# Altium project 004.tg1304ap.PrjPcb
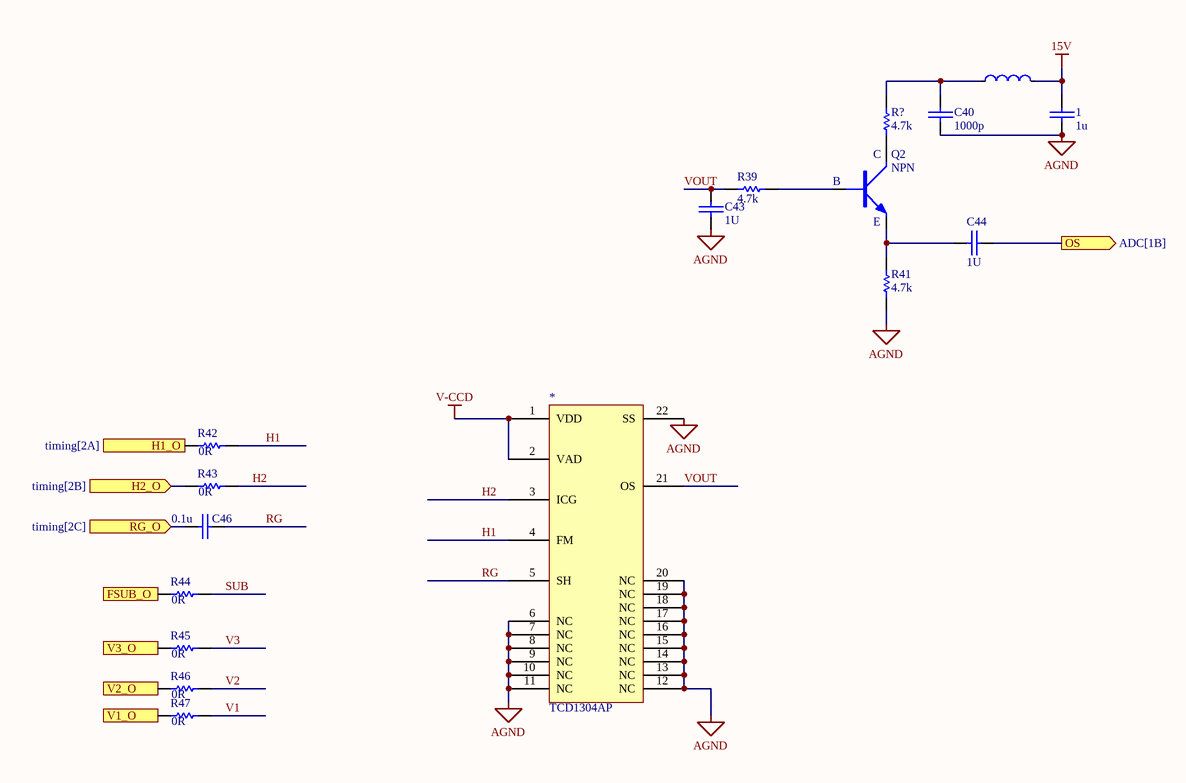
[diagram p0: CCD.SchDoc]
3 sheets, 62 parts. Net scope: flat (ports and power ports of the same name join across sheets).
Board file: PCB2.PcbDoc
Sheets:
  CCD.SchDoc
  power.SchDoc
  timing.SchDoc

## Sheet CCD.SchDoc
size A4; SheetNumber: 4; SheetTotal: 5

### Parts
1  1u  [0603C]
*  TCD1304AP  [TCD1304AP]
C40  1000p  [0603C]
C43  1U  [0603C]
C44  1U  [0603C]
C46  0.1u  [0603C]
L11  GZ1608D601TF  [0603L]  (value not drawn)
Q2  NPN  [SOT23-3]
R39  4.7k  [0603R]
R41  4.7k  [0603R]
R42  0R  [0603R]
R43  0R  [0603R]
R44  0R  [0603R]
R45  0R  [0603R]
R46  0R  [0603R]
R47  0R  [0603R]
R?  4.7k  [0603R]

### Ports
FSUB_O (in), H1_O (in, see timing[2A]), H2_O (in, see timing[2B]), OS (out, see ADC[1B]), RG_O (in, see timing[2C]), V1_O (in), V2_O (in), V3_O (in)

### Nets
15V: 1.2 L11.2
AGND: 1.1 *.6(NC) *.7(NC) *.8(NC) *.9(NC) *.10(NC) *.11(NC) *.12(NC) *.13(NC) *.14(NC) *.15(NC) *.16(NC) *.17(NC) *.18(NC) *.19(NC) *.20(NC) *.22(SS) C40.1 C43.2 R41.1
V-CCD: *.1(VDD) *.2(VAD)
H1: *.4(FM) R42.1
H2: *.3(ICG) R43.1
RG: *.5(SH) C46.1
SUB: R44.1
V1: R47.1
V2: R46.1
V3: R45.1
VOUT: *.21(OS) C43.1 R39.2
NetC40_2: C40.2 L11.1 R?.1
NetC44_1: C44.1 ; port OS
NetC44_2: C44.2 Q2.2(E) R41.2
NetC46_2: C46.2 ; port RG_O
NetQ2_1: Q2.1(B) R39.1
NetQ2_3: Q2.3(C) R?.2
NetR42_2: R42.2 ; port H1_O
NetR43_2: R43.2 ; port H2_O
NetR44_2: R44.2 ; port FSUB_O
NetR45_2: R45.2 ; port V3_O
NetR46_2: R46.2 ; port V2_O
NetR47_2: R47.2 ; port V1_O

### Library data of the parts
1 C40 C43 C44 C46 = CAP: 无极性电容
* = TCD1304AP: 排母
L11 = FB: 铁氧体磁珠; Manufacturer: Sunlord(顺络); Add into BOM: yes; Impedance @ Frequency: 600Ω@100MHz; Tolerance: ±25%; DC Resistance: 450mΩ; Current Rating: 200mA; Circuits: 1; Name: GZ1608D601TF; Symbol: GZ1608D601TF; Device: GZ1608D601TF; LCSC Part Name: 600Ω@100MHz ±25%; Supplier Part: C1002; Manufacturer Part: GZ1608D601TF; Supplier Footprint: 0603; JLCPCB Part Class: Basic Part; Datasheet: https://atta.szlcsc.com/upload/public/pdf/source/20210830/355EA7C0FAC5394FC0FE3F17C770C20A.pdf; Supplier: LCSC; Convert to PCB: yes
Q2 = NPN: NPN三极管
R39 R41-R47 R? = RES: 电阻

## Sheet power.SchDoc
size A4; SheetNumber: 2; SheetTotal: 5
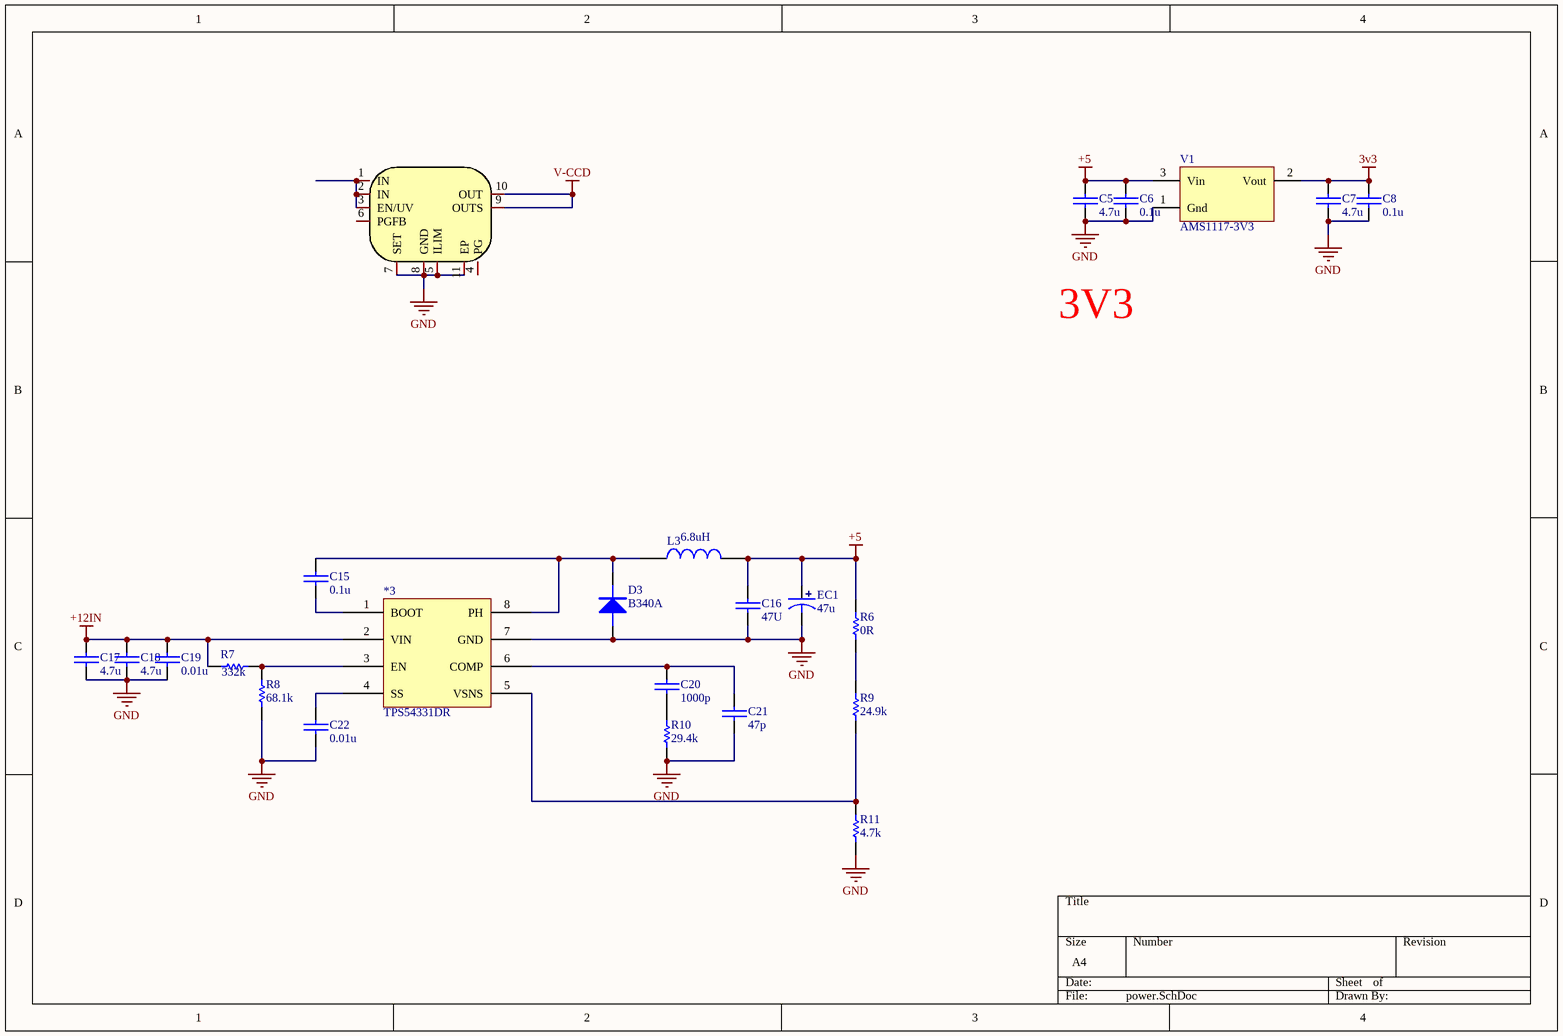
[diagram p1: power.SchDoc]

### Parts
*3  TPS54331DR  [SOIC-8]
C5  4.7u  [0603C]
C6  0.1u  [0603C]
C7  4.7u  [0603C]
C8  0.1u  [0603C]
C15  0.1u  [0603C]
C16  47U  [0603C]
C17  4.7u  [0603C]
C18  4.7u  [0603C]
C19  0.01u  [0603C]
C20  1000p  [0603C]
C21  47p  [0603C]
C22  0.01u  [0603C]
D3  B340A  [SMA/DO-214AC]
EC1  47u  [SMD-EC6.3X6.3X10]
L3  6.8uH  [L-SMD-0630]
R6  0R  [0603R]
R7  332k  [0603R]
R8  68.1k  [0603R]
R9  24.9k  [0603R]
R10  29.4k  [0603R]
R11  4.7k  [0603R]
U??  LT3045EDD#PBF  [DFN-10_L3.0-W3.0-P0.50-BL-EP]  (value not drawn)
V1  AMS1117-3V3  [SOT223_L]

### Nets
3v3: C7.2 C8.2 V1.2(Vout)
+5: C5.2 C6.2 C16.2 EC1.1 L3.2 R6.2 V1.3(Vin)
+12IN: *3.2(VIN) C17.2 C18.2 C19.2 R7.2
GND: *3.7(GND) C5.1 C6.1 C7.1 C8.1 C16.1 C17.1 C18.1 C19.1 C21.1 C22.1 D3.A EC1.2 R8.1 R10.1 R11.1 U??.5(ILIM) U??.7(SET) U??.8(GND) U??.11(EP) V1.1(Gnd)
V-CCD: U??.9(OUTS) U??.10(OUT)
Net*3_1: *3.1(BOOT) C15.1
Net*3_3: *3.3(EN) R7.1 R8.2
Net*3_4: *3.4(SS) C22.2
Net*3_5: *3.5(VSNS) R9.1 R11.2
Net*3_6: *3.6(COMP) C20.2 C21.2
Net*3_8: *3.8(PH) C15.2 D3.K L3.1
NetC20_1: C20.1 R10.2
NetR6_1: R6.1 R9.2
NetU??_1: U??.1(IN) U??.2(IN) U??.3(EN/UV)

Not connected (* = marked no-connect by the designer): U?? 4(PG) 6(PGFB)

### Notes on the sheet
- 3V3

### Library data of the parts
*3 = TPS54331DR: 降压型DC-DC
C5-C8 C15-C22 = CAP: 无极性电容
D3 = DIODE: 普通二极管
EC1 = ECAP: 贴片电解电容
L3 = L: INDUCTOR
R6-R11 = RES: 电阻
U?? = LT3045EDD#PBF: 超低噪声正极性ldo，1.8-20v，500ma; Manufacturer: ADI(亚德诺)/LINEAR(凌特); Symbol: LT3045EDD#PBF_C666574; Add into BOM: yes; Name: LT3045EDD#PBF; Device: LT3045EDD#PBF; LCSC Part Name: LT3045EDD#PBF; Supplier Part: C666574; Manufacturer Part: LT3045EDD#PBF; Supplier Footprint: DFN-10-EP(3x3); JLCPCB Part Class: Extended Part; Datasheet: https://atta.szlcsc.com/upload/public/pdf/source/20200416/C514420_E440C492D6C74EAE6AB301243586F696.pdf; Supplier: LCSC; Convert to PCB: yes; Output Type: -
V1 = AMS1117: LDO; BOM名称: 稳压芯片; 封装库来自淘宝卖家：黄晶宝石: 其他店铺购入的买家，请立即申请退款，本店现金奖励200~1000元

## Sheet timing.SchDoc
size A4; SheetNumber: 5; SheetTotal: 5
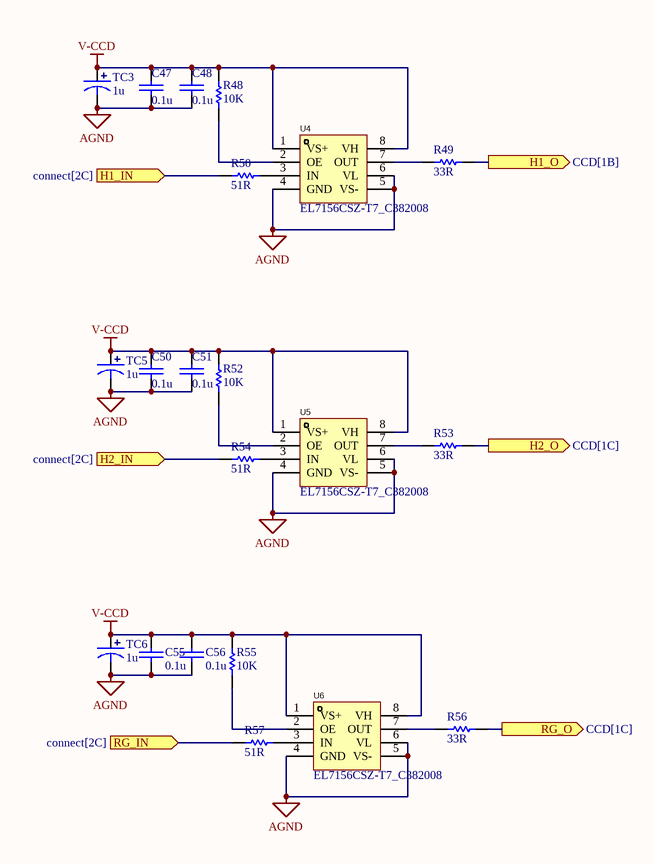
[diagram p2: timing.SchDoc]

### Parts
C47  0.1u  [0603C]
C48  0.1u  [0603C]
C50  0.1u  [0603C]
C51  0.1u  [0603C]
C55  0.1u  [0603C]
C56  0.1u  [0603C]
R48  10K  [0603R]
R49  33R  [0603R]
R50  51R  [0603R]
R52  10K  [0603R]
R53  33R  [0603R]
R54  51R  [0603R]
R55  10K  [0603R]
R56  33R  [0603R]
R57  51R  [0603R]
TC3  1u  [TAJ-A/3216]
TC5  1u  [TAJ-A/3216]
TC6  1u  [TAJ-A/3216]
U4  EL7156CSZ-T7_C382008  [SOIC-8]
U5  EL7156CSZ-T7_C382008  [SOIC-8]
U6  EL7156CSZ-T7_C382008  [SOIC-8]

### Ports
H1_IN (in, see connect[2C]), H1_O (out, see CCD[1B]), H2_IN (in, see connect[2C]), H2_O (out, see CCD[1C]), RG_IN (in, see connect[2C]), RG_O (out, see CCD[1C])

### Nets
AGND: C47.2 C48.2 C50.2 C51.2 C55.2 C56.2 TC3.2 TC5.2 TC6.2 U4.4(GND) U4.5(VS-) U4.6(VL) U5.4(GND) U5.5(VS-) U5.6(VL) U6.4(GND) U6.5(VS-) U6.6(VL)
V-CCD: C47.1 C48.1 C50.1 C51.1 C55.1 C56.1 R48.1 R52.1 R55.1 TC3.1 TC5.1 TC6.1 U4.1(VS+) U4.8(VH) U5.1(VS+) U5.8(VH) U6.1(VS+) U6.8(VH)
NetC46_2: R56.1 ; port RG_O
NetR42_2: R49.1 ; port H1_O
NetR43_2: R53.1 ; port H2_O
NetR48_2: R48.2 U4.2(OE)
NetR49_2: R49.2 U4.7(OUT)
NetR50_1: R50.1 U4.3(IN)
NetR50_2: R50.2 ; port H1_IN
NetR52_2: R52.2 U5.2(OE)
NetR53_2: R53.2 U5.7(OUT)
NetR54_1: R54.1 U5.3(IN)
NetR54_2: R54.2 ; port H2_IN
NetR55_2: R55.2 U6.2(OE)
NetR56_2: R56.2 U6.7(OUT)
NetR57_1: R57.1 U6.3(IN)
NetR57_2: R57.2 ; port RG_IN

### Library data of the parts
C47 C48 C50 C51 C55 C56 = CAP: 无极性电容
R48-R50 R52-R57 = RES: 电阻
TC3 TC5 TC6 = TCAP: 钽电容
U4-U6 = EL7156CSZ-T7: 栅极驱动器; Manufacturer: Intersil(英特矽尔); Add into BOM: yes; Name: EL7156CSZ-T7; Symbol: EL7156CSZ-T7; Device: EL7156CSZ-T7_C382008; LCSC Part Name: EL7156CSZ-T7; Supplier Part: C382008; Manufacturer Part: EL7156CSZ-T7; Supplier Footprint: SOIC-8; JLCPCB Part Class: Extended Part; Datasheet: https://atta.szlcsc.com/upload/public/pdf/source/20190409/C382008_2839965C4C72C039364B6D8C7260FFBC.pdf; Supplier: LCSC; Convert to PCB: yes

## Nets that join several sheets
AGND: CCD (20 pins), timing (18 pins)
V-CCD: CCD (*.1 *.2), power (U??.9 U??.10), timing (18 pins)
NetC46_2: CCD (C46.2), timing (R56.1)
NetR42_2: CCD (R42.2), timing (R49.1)
NetR43_2: CCD (R43.2), timing (R53.1)